# Altium schematic sheet Sensor Subsystem Gas Monitoring.SchDoc
size A; SheetNumber: 1; SheetTotal: 5
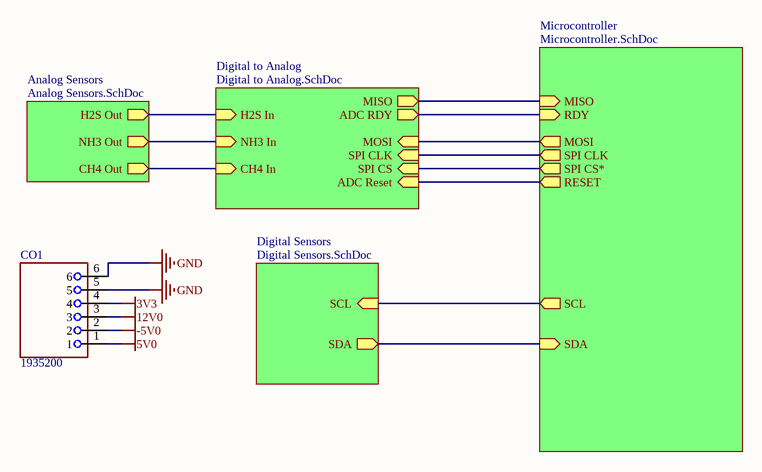
[diagram p0: Sensor Subsystem Gas Monitoring.SchDoc]

## Parts
CO1  1935200  [PHOENIX_1935200]

## Sub-sheets
Analog Sensors = Analog Sensors.SchDoc: H2S Out (out), NH3 Out (out), CH4 Out (out)
Digital Sensors = Digital Sensors.SchDoc: SDA (out), SCL (in)
Digital to Analog = Digital to Analog.SchDoc: ADC RDY (out), SPI CS (in), SPI CLK (in), ADC Reset (in), MOSI (in), MISO (out), H2S In (in), NH3 In (in), CH4 In (in)
Microcontroller = Microcontroller.SchDoc: SPI CLK (out), SPI CS* (out), MOSI (out), MISO (in), SDA (in), SCL (out), RESET (out), RDY (in)

## Nets
3V3: CO1.4
5V0: CO1.1
12V0: CO1.3
-5V0: CO1.2
GND: CO1.5 CO1.6
(unnamed): sheet Analog Sensors/H2S Out, sheet Digital to Analog/H2S In
(unnamed): sheet Analog Sensors/NH3 Out, sheet Digital to Analog/NH3 In
(unnamed): sheet Analog Sensors/CH4 Out, sheet Digital to Analog/CH4 In
(unnamed): sheet Digital Sensors/SDA, sheet Microcontroller/SDA
(unnamed): sheet Digital Sensors/SCL, sheet Microcontroller/SCL
(unnamed): sheet Digital to Analog/ADC RDY, sheet Microcontroller/RDY
(unnamed): sheet Digital to Analog/SPI CS, sheet Microcontroller/SPI CS*
(unnamed): sheet Digital to Analog/SPI CLK, sheet Microcontroller/SPI CLK
(unnamed): sheet Digital to Analog/ADC Reset, sheet Microcontroller/RESET
(unnamed): sheet Digital to Analog/MOSI, sheet Microcontroller/MOSI
(unnamed): sheet Digital to Analog/MISO, sheet Microcontroller/MISO

## Library data of the parts
CO1 = 1935200: PCB terminal block - nominal current: 17.5 A - rated voltage (III/2): 400 V - nominal cross section: 1.5 mm² - pitch: 5 mm - number of positions: 6 - connection method: Screw connection with wire protector - mounting: Wave soldering - conductor/PCB connection direction: 0 ° - color: green - Pin layout: Linear pinning - Solder pin [P]: 3.5 mm; MF: Littelfuse; SnapEDA_Link: https://www.snapeda.com/parts/1935200/Littelfuse/view-part/?ref=snap; Package: None; Value: *; MP: 1935200; Check_prices: https://www.snapeda.com/parts/1935200/Littelfuse/view-part/?ref=eda